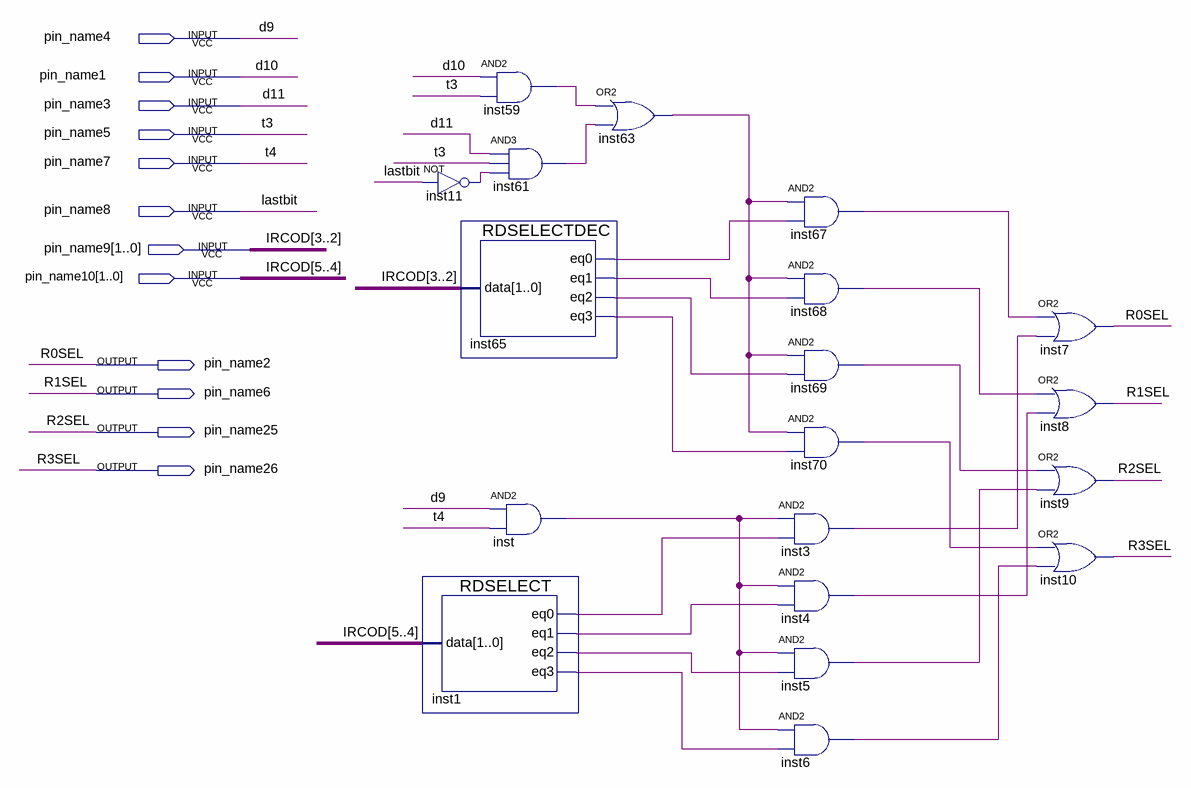
[diagram p0: schematic sheet]
// Quartus schematic Block4.bdf as structural Verilog: 19 symbols, 12 pins
module Block4 (
  input  pin_name4,
  input  pin_name1,
  input  pin_name3,
  input  pin_name5,
  input  pin_name7,
  input  pin_name8,
  input  [1:0] pin_name9,
  input  [1:0] pin_name10,
  output pin_name2,
  output pin_name6,
  output pin_name25,
  output pin_name26
);

  wire inst1_eq0, inst1_eq1, inst1_eq2, inst1_eq3, inst3_out, inst4_out, inst5_out, inst6_out, inst11_out,
       inst59_out, inst61_out, inst63_out, inst65_eq0, inst65_eq1, inst65_eq2, inst65_eq3, inst67_out,
       inst68_out, inst69_out, inst70_out, inst_out;

  not inst11 (inst11_out, pin_name8);
  RDSELECTDEC inst65 (.data(pin_name9), .eq0(inst65_eq0), .eq1(inst65_eq1), .eq2(inst65_eq2), .eq3(inst65_eq3));
  RDSELECT inst1 (.data(pin_name10), .eq0(inst1_eq0), .eq1(inst1_eq1), .eq2(inst1_eq2), .eq3(inst1_eq3));
  and inst59 (inst59_out, pin_name1, pin_name5);
  and inst61 (inst61_out, pin_name3, pin_name5, inst11_out);
  and inst (inst_out, pin_name4, pin_name7);
  or inst63 (inst63_out, inst59_out, inst61_out);
  and inst3 (inst3_out, inst_out, inst1_eq0);
  and inst4 (inst4_out, inst_out, inst1_eq1);
  and inst5 (inst5_out, inst_out, inst1_eq2);
  and inst6 (inst6_out, inst_out, inst1_eq3);
  and inst67 (inst67_out, inst63_out, inst65_eq0);
  and inst68 (inst68_out, inst63_out, inst65_eq1);
  and inst69 (inst69_out, inst63_out, inst65_eq2);
  and inst70 (inst70_out, inst63_out, inst65_eq3);
  or inst7 (pin_name2, inst67_out, inst3_out);
  or inst8 (pin_name6, inst68_out, inst4_out);
  or inst9 (pin_name25, inst69_out, inst5_out);
  or inst10 (pin_name26, inst70_out, inst6_out);

  // Other names for the same wires on the sheet: d9 = pin_name4; d10 = pin_name1; d11 = pin_name3;
  //   IRCOD[5:2] = {pin_name10, pin_name9}; lastbit = pin_name8; R0SEL = pin_name2; R1SEL = pin_name6;
  //   R2SEL = pin_name25; R3SEL = pin_name26; t3 = pin_name5; t4 = pin_name7
endmodule
